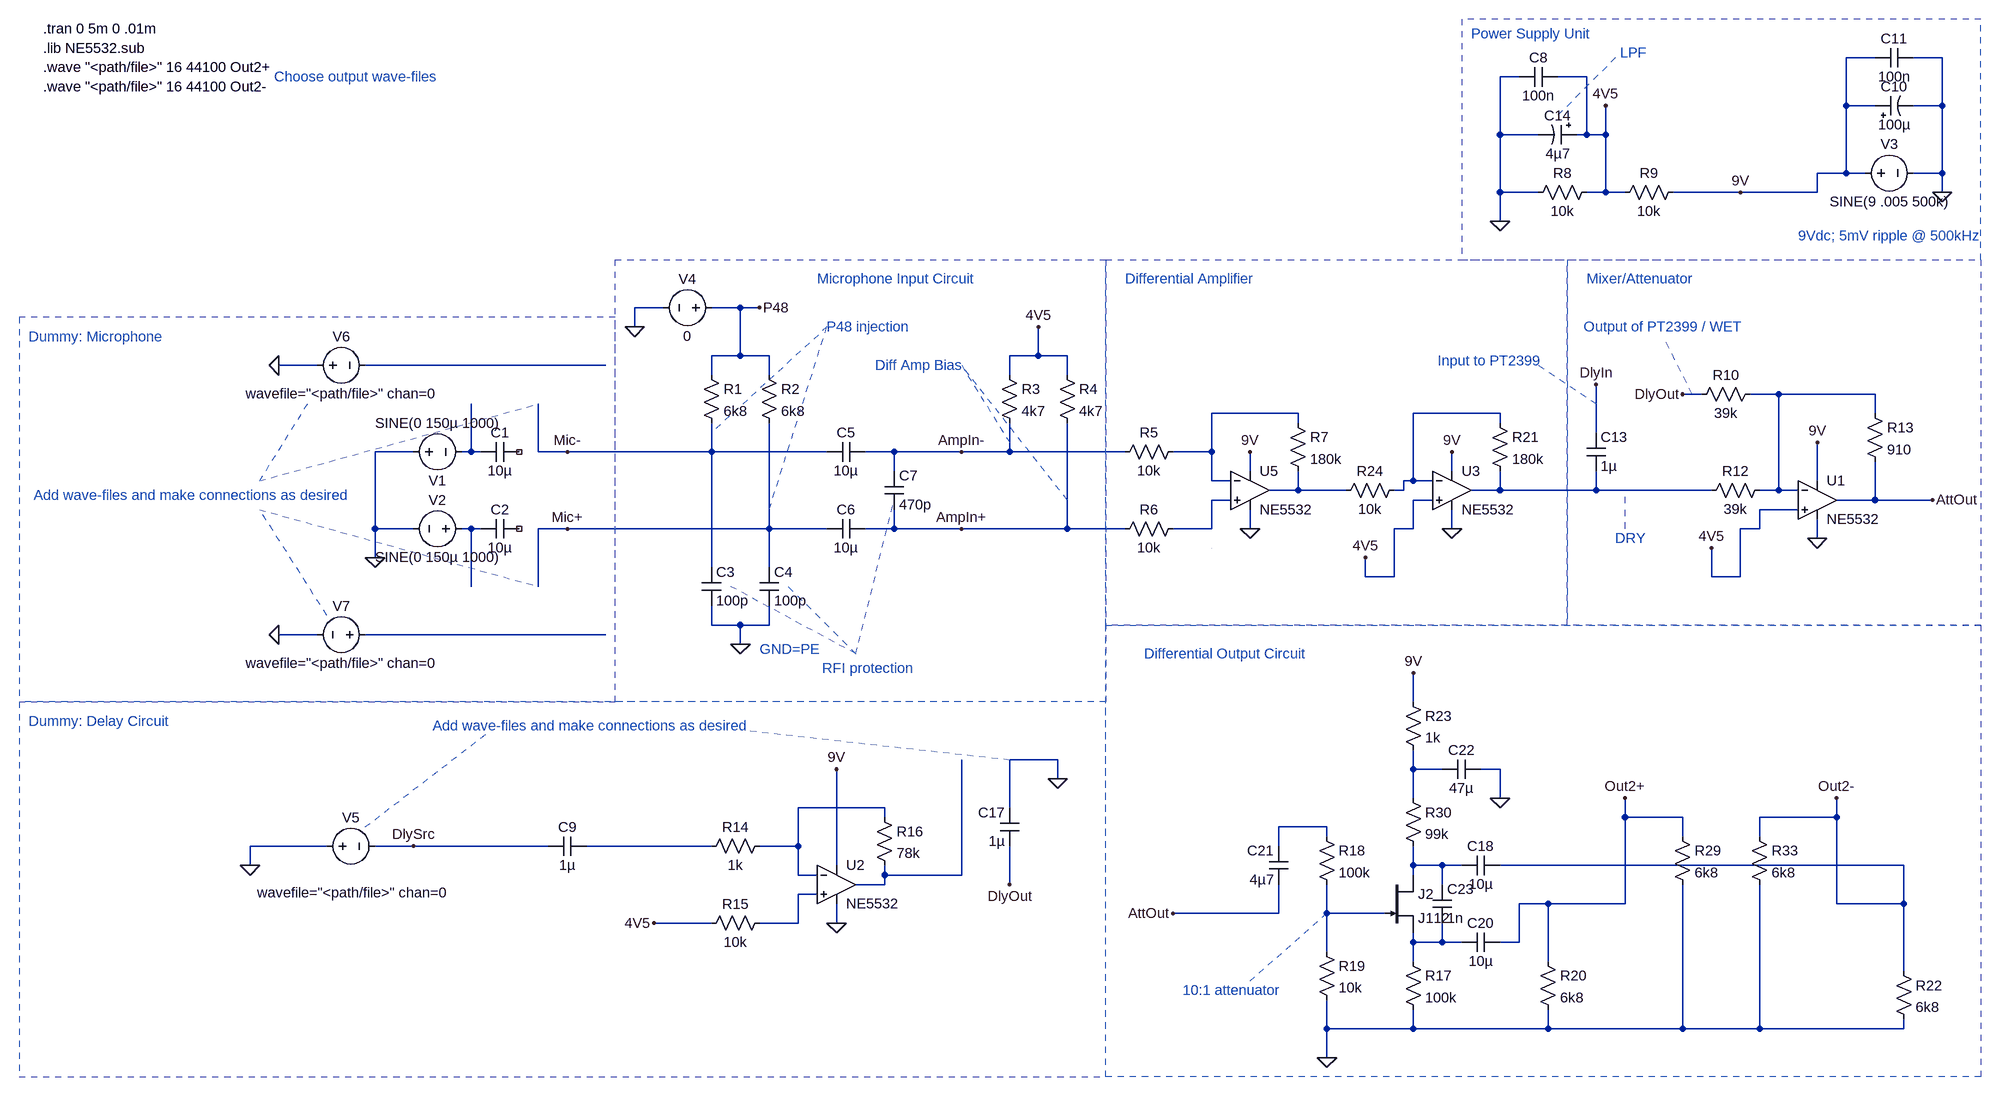
[diagram p0: schematic TripleDelay2399.asc]
TripleDelay2399.asc, the LTspice schematic file:
Version 4
SHEET 1 3316 1012
WIRE 1952 -688 1904 -688
WIRE 2064 -688 2016 -688
WIRE 1360 -656 1328 -656
WIRE 1472 -656 1424 -656
WIRE 1904 -608 1904 -688
WIRE 1952 -608 1904 -608
WIRE 2064 -608 2064 -688
WIRE 2064 -608 2016 -608
WIRE 1328 -560 1328 -656
WIRE 1392 -560 1328 -560
WIRE 1472 -560 1472 -656
WIRE 1472 -560 1456 -560
WIRE 1504 -560 1504 -608
WIRE 1504 -560 1472 -560
WIRE 1904 -496 1904 -608
WIRE 1904 -496 1856 -496
WIRE 1936 -496 1904 -496
WIRE 2064 -496 2064 -608
WIRE 2064 -496 2016 -496
WIRE 1328 -464 1328 -560
WIRE 1392 -464 1328 -464
WIRE 1504 -464 1504 -560
WIRE 1504 -464 1472 -464
WIRE 1536 -464 1504 -464
WIRE 1728 -464 1616 -464
WIRE 1856 -464 1856 -496
WIRE 1856 -464 1728 -464
WIRE 2064 -464 2064 -496
WIRE 1328 -416 1328 -464
WIRE -64 -272 -112 -272
WIRE 64 -272 16 -272
WIRE 96 -272 64 -272
WIRE -112 -240 -112 -272
WIRE 64 -192 64 -272
WIRE 64 -192 16 -192
WIRE 112 -192 64 -192
WIRE 560 -192 560 -240
WIRE 560 -192 512 -192
WIRE 608 -192 560 -192
WIRE -640 -176 -704 -176
WIRE -160 -176 -560 -176
WIRE 16 -160 16 -192
WIRE 112 -160 112 -192
WIRE 512 -160 512 -192
WIRE 608 -160 608 -192
WIRE 1664 -128 1632 -128
WIRE 1792 -128 1744 -128
WIRE 1952 -128 1792 -128
WIRE 992 -96 848 -96
WIRE 1328 -96 1184 -96
WIRE 1952 -96 1952 -128
WIRE 992 -80 992 -96
WIRE 1328 -80 1328 -96
WIRE 1488 -64 1488 -144
WIRE -480 -32 -544 -32
WIRE -384 -32 -384 -112
WIRE -384 -32 -400 -32
WIRE -368 -32 -384 -32
WIRE -272 -32 -272 -112
WIRE -224 -32 -272 -32
WIRE 16 -32 16 -80
WIRE 16 -32 -224 -32
WIRE 208 -32 16 -32
WIRE 320 -32 272 -32
WIRE 432 -32 320 -32
WIRE 512 -32 512 -80
WIRE 512 -32 432 -32
WIRE 704 -32 512 -32
WIRE 848 -32 848 -96
WIRE 848 -32 784 -32
WIRE 320 0 320 -32
WIRE 912 0 912 -32
WIRE 1248 0 1248 -32
WIRE 848 16 848 -32
WIRE 880 16 848 16
WIRE 1184 16 1184 -96
WIRE 1184 16 1168 16
WIRE 1216 16 1184 16
WIRE 1856 16 1856 -48
WIRE 992 32 992 0
WIRE 992 32 944 32
WIRE 1072 32 992 32
WIRE 1168 32 1168 16
WIRE 1168 32 1152 32
WIRE 1328 32 1328 0
WIRE 1328 32 1280 32
WIRE 1488 32 1488 0
WIRE 1488 32 1328 32
WIRE 1680 32 1488 32
WIRE 1792 32 1792 -128
WIRE 1792 32 1760 32
WIRE 1824 32 1792 32
WIRE 880 48 848 48
WIRE 1216 48 1184 48
WIRE 1952 48 1952 -16
WIRE 1952 48 1888 48
WIRE 2048 48 1952 48
WIRE 1824 64 1760 64
WIRE -544 96 -544 -32
WIRE -480 96 -544 96
WIRE -384 96 -400 96
WIRE -368 96 -384 96
WIRE -224 96 -272 96
WIRE 112 96 112 -80
WIRE 112 96 -224 96
WIRE 208 96 112 96
WIRE 320 96 320 64
WIRE 320 96 272 96
WIRE 432 96 320 96
WIRE 608 96 608 -80
WIRE 608 96 432 96
WIRE 704 96 608 96
WIRE 848 96 848 48
WIRE 848 96 784 96
WIRE 912 96 912 64
WIRE 1184 96 1184 48
WIRE 1184 96 1152 96
WIRE 1248 96 1248 64
WIRE 1760 96 1760 64
WIRE 1760 96 1728 96
WIRE 1856 112 1856 80
WIRE -544 144 -544 96
WIRE 16 160 16 -32
WIRE 112 160 112 96
WIRE 1104 176 1104 144
WIRE 1152 176 1152 96
WIRE 1152 176 1104 176
WIRE 1680 176 1680 128
WIRE 1728 176 1728 96
WIRE 1728 176 1680 176
WIRE -384 192 -384 96
WIRE -272 192 -272 96
WIRE 16 256 16 224
WIRE 64 256 16 256
WIRE 112 256 112 224
WIRE 112 256 64 256
WIRE -640 272 -704 272
WIRE -160 272 -560 272
WIRE 64 288 64 256
WIRE 1184 384 1184 336
WIRE 592 480 512 480
WIRE 1184 496 1184 464
WIRE 1232 496 1184 496
WIRE 1328 496 1296 496
WIRE 592 512 592 480
WIRE 1184 544 1184 496
WIRE 1328 544 1328 496
WIRE 304 560 160 560
WIRE 512 560 512 480
WIRE 304 576 304 560
WIRE 1536 576 1536 544
WIRE 1632 576 1536 576
WIRE 1888 576 1888 544
WIRE 1888 576 1760 576
WIRE 1040 592 960 592
WIRE 1040 608 1040 592
WIRE 1632 608 1632 576
WIRE 1760 608 1760 576
WIRE -624 624 -752 624
WIRE -480 624 -544 624
WIRE -256 624 -480 624
WIRE 16 624 -192 624
WIRE 160 624 160 560
WIRE 160 624 96 624
WIRE 960 624 960 592
WIRE -752 656 -752 624
WIRE 224 656 224 496
WIRE 1184 656 1184 624
WIRE 1232 656 1184 656
WIRE 1264 656 1232 656
WIRE 2000 656 1328 656
WIRE 160 672 160 624
WIRE 192 672 160 672
WIRE 304 672 304 656
WIRE 432 672 432 480
WIRE 432 672 304 672
WIRE 1184 672 1184 656
WIRE 304 688 304 672
WIRE 304 688 256 688
WIRE 512 688 512 624
WIRE 1232 688 1232 656
WIRE 192 704 160 704
WIRE 1408 720 1360 720
WIRE 1536 720 1536 576
WIRE 1536 720 1408 720
WIRE 1888 720 1888 576
WIRE 2000 720 2000 656
WIRE 2000 720 1888 720
WIRE 960 736 960 688
WIRE 960 736 784 736
WIRE 1040 736 1040 688
WIRE 1136 736 1040 736
WIRE 16 752 -80 752
WIRE 160 752 160 704
WIRE 160 752 96 752
WIRE 224 752 224 720
WIRE 1184 784 1184 768
WIRE 1232 784 1232 752
WIRE 1232 784 1184 784
WIRE 1264 784 1232 784
WIRE 1360 784 1360 720
WIRE 1360 784 1328 784
WIRE 1040 800 1040 736
WIRE 1184 816 1184 784
WIRE 1408 816 1408 720
WIRE 2000 832 2000 720
WIRE 1040 928 1040 880
WIRE 1184 928 1184 896
WIRE 1184 928 1040 928
WIRE 1408 928 1408 896
WIRE 1408 928 1184 928
WIRE 1632 928 1632 688
WIRE 1632 928 1408 928
WIRE 1760 928 1760 688
WIRE 1760 928 1632 928
WIRE 2000 928 2000 912
WIRE 2000 928 1760 928
WIRE 1040 976 1040 928
FLAG -544 144 0
FLAG 64 288 0
FLAG 912 96 0
FLAG 1328 -416 0
FLAG -112 -240 0
FLAG 2064 -464 0
FLAG -224 96 Mic+
FLAG -224 -32 Mic-
FLAG 432 -32 AmpIn-
FLAG 432 96 AmpIn+
FLAG 1728 -464 9V
FLAG 1504 -608 4V5
FLAG 96 -272 P48
FLAG 1856 112 0
FLAG 2048 48 AttOut
FLAG 1680 128 4V5
FLAG -752 656 0
FLAG -704 -176 0
FLAG -704 272 0
FLAG 512 688 DlyOut
FLAG 1632 -128 DlyOut
FLAG -480 624 DlySrc
FLAG 224 752 0
FLAG -80 752 4V5
FLAG 224 496 9V
FLAG 560 -240 4V5
FLAG 912 -32 9V
FLAG 1856 -48 9V
FLAG 1488 -144 DlyIn
FLAG 1040 976 0
FLAG 1536 544 Out2+
FLAG 1888 544 Out2-
FLAG 1328 544 0
FLAG 1184 336 9V
FLAG 784 736 AttOut
FLAG 1248 96 0
FLAG 1248 -32 9V
FLAG 1104 144 4V5
FLAG 592 512 0
SYMBOL voltage -496 -32 R270
WINDOW 0 -32 56 VBottom 2
WINDOW 3 32 56 VTop 2
WINDOW 123 0 0 Left 2
WINDOW 39 0 0 Left 2
SYMATTR InstName V1
SYMATTR Value SINE(0 150µ 1000)
SYMBOL voltage -384 96 R90
WINDOW 0 -32 56 VBottom 2
WINDOW 3 32 56 VTop 2
WINDOW 123 0 0 Left 2
WINDOW 39 0 0 Left 2
SYMATTR InstName V2
SYMATTR Value SINE(0 150µ 1000)
SYMBOL cap -304 -48 R90
WINDOW 0 0 32 VBottom 2
WINDOW 3 32 32 VTop 2
SYMATTR InstName C1
SYMATTR Value 10µ
SYMBOL cap -304 80 R90
WINDOW 0 0 32 VBottom 2
WINDOW 3 32 32 VTop 2
SYMATTR InstName C2
SYMATTR Value 10µ
SYMBOL res 0 -176 R0
SYMATTR InstName R1
SYMATTR Value 6k8
SYMBOL res 96 -176 R0
SYMATTR InstName R2
SYMATTR Value 6k8
SYMBOL cap 0 160 R0
SYMATTR InstName C3
SYMATTR Value 100p
SYMBOL cap 96 160 R0
SYMATTR InstName C4
SYMATTR Value 100p
SYMBOL cap 272 -48 R90
WINDOW 0 0 32 VBottom 2
WINDOW 3 32 32 VTop 2
SYMATTR InstName C5
SYMATTR Value 10µ
SYMBOL cap 272 80 R90
WINDOW 0 0 32 VBottom 2
WINDOW 3 32 32 VTop 2
SYMATTR InstName C6
SYMATTR Value 10µ
SYMBOL cap 304 0 R0
SYMATTR InstName C7
SYMATTR Value 470p
SYMBOL res 496 -176 R0
SYMATTR InstName R3
SYMATTR Value 4k7
SYMBOL res 592 -176 R0
SYMATTR InstName R4
SYMATTR Value 4k7
SYMBOL res 800 -48 R90
WINDOW 0 0 56 VBottom 2
WINDOW 3 32 56 VTop 2
SYMATTR InstName R5
SYMATTR Value 10k
SYMBOL res 800 80 R90
WINDOW 0 0 56 VBottom 2
WINDOW 3 32 56 VTop 2
SYMATTR InstName R6
SYMATTR Value 10k
SYMBOL res 976 -96 R0
SYMATTR InstName R7
SYMATTR Value 180k
SYMBOL res 1488 -480 R90
WINDOW 0 0 56 VBottom 2
WINDOW 3 32 56 VTop 2
SYMATTR InstName R8
SYMATTR Value 10k
SYMBOL res 1632 -480 R90
WINDOW 0 0 56 VBottom 2
WINDOW 3 32 56 VTop 2
SYMATTR InstName R9
SYMATTR Value 10k
SYMBOL voltage 1920 -496 R270
WINDOW 0 32 56 VTop 2
WINDOW 3 -32 56 VBottom 2
WINDOW 123 0 0 Left 2
WINDOW 39 0 0 Left 2
SYMATTR InstName V3
SYMATTR Value SINE(9 .005 500k)
SYMBOL voltage 32 -272 R90
WINDOW 0 -32 56 VBottom 2
WINDOW 3 32 56 VTop 2
WINDOW 123 0 0 Left 2
WINDOW 39 0 0 Left 2
SYMATTR InstName V4
SYMATTR Value 0
SYMBOL cap 2016 -704 R90
WINDOW 0 0 32 VBottom 2
WINDOW 3 32 32 VTop 2
SYMATTR InstName C11
SYMATTR Value 100n
SYMBOL res 1776 16 R90
WINDOW 0 0 56 VBottom 2
WINDOW 3 32 56 VTop 2
SYMATTR InstName R12
SYMATTR Value 39k
SYMBOL res 1936 -112 R0
SYMATTR InstName R13
SYMATTR Value 910
SYMBOL polcap 1456 -576 R90
WINDOW 0 0 32 VBottom 2
WINDOW 3 32 32 VTop 2
SYMATTR InstName C14
SYMATTR Value 4µ7
SYMATTR SpiceLine V=25 Irms=24m Rser=5 Lser=0
SYMBOL polcap 1952 -592 R270
WINDOW 0 32 32 VTop 2
WINDOW 3 0 32 VBottom 2
SYMATTR InstName C10
SYMATTR Value 100µ
SYMATTR SpiceLine V=35 Irms=190m Rser=0.5 Lser=0 mfg="Nichicon" pn="UPR1V101MPH" type="Al electrolytic"
SYMBOL Opamps\\opamp2 912 -32 R0
SYMATTR InstName U5
SYMATTR Value NE5532
SYMBOL Opamps\\opamp2 1856 -16 R0
SYMATTR InstName U1
SYMATTR Value NE5532
SYMBOL cap 1424 -672 R90
WINDOW 0 0 32 VBottom 2
WINDOW 3 32 32 VTop 2
SYMATTR InstName C8
SYMATTR Value 100n
SYMBOL cap 1472 -64 R0
SYMATTR InstName C13
SYMATTR Value 1µ
SYMBOL cap 528 624 R180
WINDOW 0 24 56 Left 2
WINDOW 3 24 8 Left 2
SYMATTR InstName C17
SYMATTR Value 1µ
SYMBOL res 1760 -144 R90
WINDOW 0 0 56 VBottom 2
WINDOW 3 32 56 VTop 2
SYMATTR InstName R10
SYMATTR Value 39k
SYMBOL voltage -656 -176 R270
WINDOW 0 32 56 VTop 2
WINDOW 3 -32 56 VBottom 2
SYMATTR InstName V6
SYMATTR Value wavefile="<path/file>" chan=0
SYMBOL voltage -544 272 R90
WINDOW 0 -32 56 VBottom 2
WINDOW 3 32 56 VTop 2
SYMATTR InstName V7
SYMATTR Value wavefile="<path/file>" chan=0
SYMBOL voltage -640 624 R270
WINDOW 0 32 56 VTop 2
WINDOW 3 -62 59 VBottom 2
SYMATTR InstName V5
SYMATTR Value wavefile="<path/file>" chan=0
SYMBOL res 112 608 R90
WINDOW 0 0 56 VBottom 2
WINDOW 3 32 56 VTop 2
SYMATTR InstName R14
SYMATTR Value 1k
SYMBOL res 112 736 R90
WINDOW 0 0 56 VBottom 2
WINDOW 3 32 56 VTop 2
SYMATTR InstName R15
SYMATTR Value 10k
SYMBOL res 288 560 R0
SYMATTR InstName R16
SYMATTR Value 78k
SYMBOL Opamps\\opamp2 224 624 R0
SYMATTR InstName U2
SYMATTR Value NE5532
SYMBOL cap -192 608 R90
WINDOW 0 0 32 VBottom 2
WINDOW 3 32 32 VTop 2
SYMATTR InstName C9
SYMATTR Value 1µ
SYMBOL njf 1136 672 R0
SYMATTR InstName J2
SYMATTR Value J112
SYMBOL res 1168 800 R0
SYMATTR InstName R17
SYMATTR Value 100k
SYMBOL res 1024 592 R0
SYMATTR InstName R18
SYMATTR Value 100k
SYMBOL res 1024 784 R0
SYMATTR InstName R19
SYMATTR Value 10k
SYMBOL res 1392 800 R0
SYMATTR InstName R20
SYMATTR Value 6k8
SYMBOL res 1984 816 R0
SYMATTR InstName R22
SYMATTR Value 6k8
SYMBOL cap 1328 640 R90
WINDOW 0 0 32 VBottom 2
WINDOW 3 32 32 VTop 2
SYMATTR InstName C18
SYMATTR Value 10µ
SYMBOL cap 1328 768 R90
WINDOW 0 0 32 VBottom 2
WINDOW 3 32 32 VTop 2
SYMATTR InstName C20
SYMATTR Value 10µ
SYMBOL cap 976 688 R180
WINDOW 0 24 56 Left 2
WINDOW 3 24 8 Left 2
SYMATTR InstName C21
SYMATTR Value 4µ7
SYMBOL res 1168 368 R0
SYMATTR InstName R23
SYMATTR Value 1k
SYMBOL cap 1296 480 R90
WINDOW 0 0 32 VBottom 2
WINDOW 3 32 32 VTop 2
SYMATTR InstName C22
SYMATTR Value 47µ
SYMBOL res 1168 528 R0
SYMATTR InstName R30
SYMATTR Value 99k
SYMBOL cap 1216 688 R0
SYMATTR InstName C23
SYMATTR Value 1n
SYMBOL res 1616 592 R0
SYMATTR InstName R29
SYMATTR Value 6k8
SYMBOL res 1744 592 R0
SYMATTR InstName R33
SYMATTR Value 6k8
SYMBOL res 1312 -96 R0
SYMATTR InstName R21
SYMATTR Value 180k
SYMBOL Opamps\\opamp2 1248 -32 R0
SYMATTR InstName U3
SYMATTR Value NE5532
SYMBOL res 1168 16 R90
WINDOW 0 0 56 VBottom 2
WINDOW 3 32 56 VTop 2
SYMATTR InstName R24
SYMATTR Value 10k
TEXT -1096 -736 Left 2 !.tran 0 5m 0 .01m
TEXT 96 296 Left 2 ;GND=PE
TEXT -1096 -704 Left 2 !.lib NE5532.sub
TEXT -1096 -672 Left 2 !.wave "<path/file>" 16 44100 Out2+
TEXT -1096 -640 Left 2 !.wave "<path/file>" 16 44100 Out2-
TEXT 1280 -728 Left 2 ;Power Supply Unit
TEXT -1120 -224 Left 2 ;Dummy: Microphone
TEXT -1120 416 Left 2 ;Dummy: Delay Circuit
TEXT 192 -320 Left 2 ;Microphone Input Circuit
TEXT 704 -320 Left 2 ;Differential Amplifier
TEXT 1472 -320 Left 2 ;Mixer/Attenuator
TEXT 200 328 Left 2 ;RFI protection
TEXT 288 -176 Left 2 ;Diff Amp Bias
TEXT 208 -240 Left 2 ;P48 injection
TEXT 1528 -696 Left 2 ;LPF
TEXT 1224 -184 Left 2 ;Input to PT2399
TEXT 1600 -240 Center 2 ;Output of PT2399 / WET
TEXT 1520 112 Left 2 ;DRY
TEXT 1824 -392 Left 2 ;9Vdc; 5mV ripple @ 500kHz
TEXT 736 304 Left 2 ;Differential Output Circuit
TEXT 800 864 Left 2 ;10:1 attenuator
TEXT -1112 40 Left 2 ;Add wave-files and make connections as desired
TEXT -448 424 Left 2 ;Add wave-files and make connections as desired
TEXT -712 -656 Left 2 ;Choose output wave-files
LINE Normal 256 304 48 192 2
LINE Normal 144 192 256 304 2
LINE Normal 144 192 144 192 2
LINE Normal 256 304 320 48 2
LINE Normal 432 -176 512 -48 2
LINE Normal 608 48 432 -176 2
LINE Normal 208 -240 16 -64 2
LINE Normal 112 64 208 -240 2
LINE Normal 1520 -688 1424 -592 2
LINE Normal 1392 -176 1488 -112 2
LINE Normal 1648 -128 1600 -224 2
LINE Normal 1536 96 1536 32 2
LINE Normal 848 128 848 128 2
LINE Normal 912 848 1040 736 2
LINE Normal 80 432 512 480 2
LINE Normal 80 432 80 432 2
LINE Normal 80 432 80 432 2
LINE Normal 80 432 80 432 2
LINE Normal 80 432 80 432 2
LINE Normal -560 592 -352 432 2
LINE Normal -560 592 -560 592 2
LINE Normal -736 16 -656 -112 2
LINE Normal -736 16 -736 16 2
LINE Normal -624 240 -736 64 2
LINE Normal -624 240 -624 240 2
LINE Normal -736 16 -272 -112 2
LINE Normal -736 16 -736 16 2
LINE Normal -736 64 -272 192 2
LINE Normal -736 64 -736 64 2
RECTANGLE Normal 1264 -352 2128 -752 2
RECTANGLE Normal -1136 384 -144 -256 2
RECTANGLE Normal 672 384 -144 -352 2
RECTANGLE Normal 2128 1008 672 256 2
RECTANGLE Normal -1136 1008 672 384 2
RECTANGLE Normal 1440 256 672 -352 2
RECTANGLE Normal 2128 256 1440 -352 2

The netlist it stands for:
* TripleDelay2399.asc
V1 0 N005 SINE(0 150µ 1000)
V2 N009 0 SINE(0 150µ 1000)
C1 NC_01 N005 10µ
C2 NC_02 N009 10µ
R1 P48 Mic- 6k8
R2 P48 Mic+ 6k8
C3 Mic- 0 100p
C4 Mic+ 0 100p
C5 AmpIn- Mic- 10µ
C6 AmpIn+ Mic+ 10µ
C7 AmpIn- AmpIn+ 470p
R3 4V5 AmpIn- 4k7
R4 4V5 AmpIn+ 4k7
R5 N003 AmpIn- 10k
R6 N008 AmpIn+ 10k
R7 N003 N006 180k
R8 4V5 0 10k
R9 9V 4V5 10k
V3 9V 0 SINE(9 .005 500k)
V4 P48 0 0
C11 0 9V 100n
R12 N002 N007 39k
R13 N002 AttOut 910
C14 4V5 0 4µ7 V=25 Irms=24m Rser=5 Lser=0
C10 9V 0 100µ V=35 Irms=190m Rser=0.5 Lser=0 mfg="Nichicon" pn="UPR1V101MPH" type="Al electrolytic"
XU5 N008 N003 9V 0 N006 NE5532  ; pins In+ In- V+ V- OUT
XU1 4V5 N002 9V 0 AttOut NE5532  ; pins In+ In- V+ V- OUT
C8 4V5 0 100n
C13 DlyIn N007 1µ
C17 DlyOut 0 1µ
R10 N002 DlyOut 39k
V6 0 N001 wavefile="<path/file>" chan=0
V7 N010 0 wavefile="<path/file>" chan=0
V5 0 DlySrc wavefile="<path/file>" chan=0
R14 N012 N014 1k
R15 N017 4V5 10k
R16 N012 N016 78k
XU2 N017 N012 9V 0 N016 NE5532  ; pins In+ In- V+ V- OUT
C9 N014 DlySrc 1µ
J2 N015 N018 N019 J112
R17 N019 0 100k
R18 N013 N018 100k
R19 N018 0 10k
R20 Out2+ 0 6k8
R22 Out2- 0 6k8
C18 Out2- N015 10µ
C20 Out2+ N019 10µ
C21 AttOut N013 4µ7
R23 9V N011 1k
C22 0 N011 47µ
R30 N011 N015 99k
C23 N015 N019 1n
R29 Out2+ 0 6k8
R33 Out2- 0 6k8
R21 N004 N007 180k
XU3 4V5 N004 9V 0 N007 NE5532  ; pins In+ In- V+ V- OUT
R24 N004 N006 10k
.model NJF NJF
.model PJF PJF
.lib standard.jft
.tran 0 5m 0 .01m
* GND=PE
.lib NE5532.sub
.wave "<path/file>" 16 44100 Out2+
.wave "<path/file>" 16 44100 Out2-
* Power Supply Unit
* Dummy: Microphone
* Dummy: Delay Circuit
* Microphone Input Circuit
* Differential Amplifier
* Mixer/Attenuator
* RFI protection
* Diff Amp Bias
* P48 injection
* LPF
* Input to PT2399
* Output of PT2399 / WET
* DRY
* 9Vdc; 5mV ripple @ 500kHz
* Differential Output Circuit
* 10:1 attenuator
* Add wave-files and make connections as desired
* Add wave-files and make connections as desired
* Choose output wave-files
.backanno
.end